# EAGLE design board (EAGLE 9.6.2)
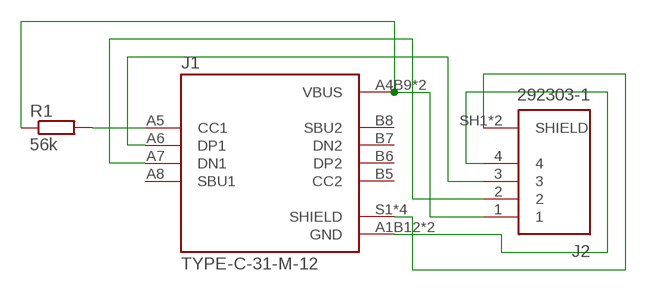
[diagram p0: schematic, sheet 1]

## Parts
J1  TYPE-C-31-M-12  [HRO_TYPE-C-31-M-12]
J2  292303-1  [292303-1]
R1  56k  RESISTOR-0603  [R0603]

## Nets
N$1: J1.A1B12(GND) J1.B1A12(GND) J2.4
N$2: J1.S1(SHIELD) J1.S2(SHIELD) J1.S3(SHIELD) J1.S4(SHIELD) J2.SH1(SHIELD) J2.SH2(SHIELD)
N$3: J1.A4B9(VBUS) J1.B4A9(VBUS) J2.1 R1.1
N$4: J1.A6(DP1) J2.3
N$5: J1.A7(DN1) J2.2
N$6: J1.A5(CC1) R1.2
Unconnected: J1.A8(SBU1) J1.B5(CC2) J1.B6(DP2) J1.B7(DN2) J1.B8(SBU2)

## Library data of the parts
J1 = TYPE-C-31-M-12:TYPE-C-31-M-12: USB Connectors 24 Receptacle 1 8.94*7.3mm RoHS; AVAILABILITY: Unavailable; DESCRIPTION: USB Connectors 24 Receptacle 1 8.94*7.3mm RoHS; MF: HRO Electronics Co., Ltd.; MP: TYPE-C-31-M-12; PACKAGE: Package; PRICE: None
J2 = USB connector:292303-1: CONN RCPT USB2.0 TYPEA 4POS R/A Manufacturer's datasheet <https://www.te.com/commerce/DocumentDelivery/DDEController?Action=srchrtrv&DocNm=292303&DocType=Customer+Drawing&DocLang=English>; CREATED_BY: PCBLayout.com; DIGIKEY_PARTNO: A31726-ND; MANUFACTURER: TE Connectivity AMP Connectors; MPN: 292303-1
R1 = Components:RESISTOR

## Board
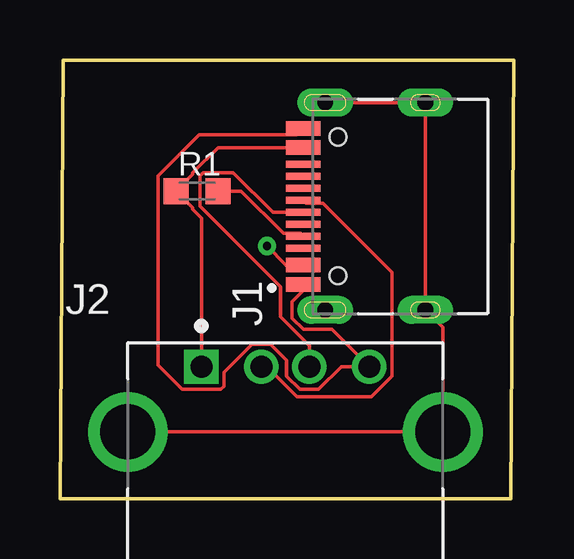
[diagram p1: board, top side]
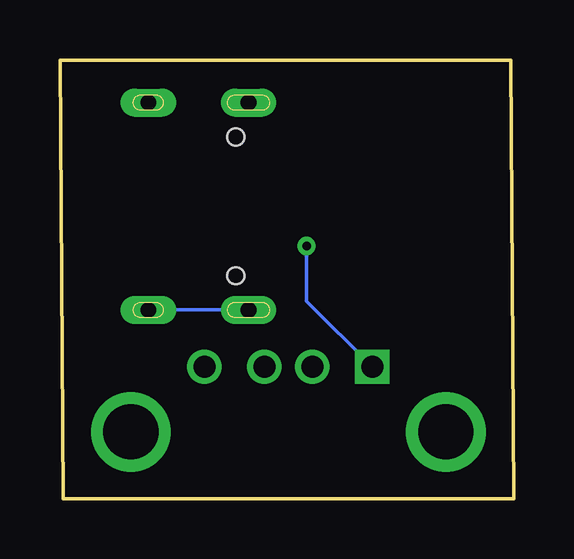
[diagram p2: board, bottom side, seen from below]

Size 18.92 x 18.29 mm. Coordinates in mm from the lower left corner, seen from the top.
Outline: 0,0 18.8,0 18.92,18.29 0.13,18.29 0,0
Copper layers (1*16): Top 0.035mm / dielectric 1.5mm / Bottom 0.035mm
Design rules "default": minimum track width 6mil, minimum drill 0.35mm, track to track 6mil, track to pad 6mil, pad to pad 6mil, via to via 6mil, smd to smd 6mil, copper to edge 40mil, drill to drill 6mil, minimum pad ring 10mil, minimum via ring 8mil, stop-mask expansion 4mil, vias tented up to drill 0mil, thermal gap 10mil

### Footprints (pad centres in the part's own frame; a part is rotated, then mirrored left to right if it is on the bottom)
HRO_TYPE-C-31-M-12 = smd 0.6 x 1.45: A1B12 -3.25,5.095; A4B9 -2.45,5.095; B1A12 3.25,5.095; B4A9 2.45,5.095 | smd 0.3 x 1.45: A5 -1.25,5.095; A6 -0.25,5.095; A7 0.25,5.095; A8 1.25,5.095; B5 1.75,5.095; B6 0.75,5.095; B7 -0.75,5.095; B8 -1.75,5.095 | drill 0.65 pad 1.05 long: S1 -4.32,4.18; S2 4.32,4.18; S3 -4.32,0; S4 4.32,0 | hole 0.7: -2.89,3.65; 2.89,3.65
292303-1 = drill 0.92 square: 1 -3.5,2.71 | drill 0.92: 2 -1,2.71; 3 1,2.71; 4 3.5,2.71 | drill 2.3: SH1 -6.57,0; SH2 6.57,0
R0603 = smd 1.05 x 1.08: 1 -0.875,0; 2 0.875,0

### Placement (x,y rotation side)
J1  15.24,12.19 90 top
J2  9.4,2.79 0 top
R1  5.71,12.83 0 top

### Tracks (layer width: path | path; a pad name or v marks a point on that pad's centre or on a via)
N$1
  Top 0.152: J1.A1B12 10.14,8.68 9.67,8.21 9.67,7.54 10.15,7.06 11.34,7.06 J2.4 11.73,5.5 10.79,4.56 10.01,4.56 9.46,5.11 9.46,5.78 8.79,6.45 8.01,6.45 6.84,5.28 6.84,4.7 6.71,4.56 5.09,4.56 4.09,5.56 4.09,13.46 5.79,15.17 9.87,15.17 J1.B1A12
N$2
  Top 0.152: J1.S2 J1.S4 J1.S3 15.97,7.14 J2.SH2 J2.SH1
  Bottom 0.152: J1.S1 J1.S3
N$3  (via drill 0.35)
  Top 0.152: J2.1 5.9,11.7 5.53,12.07 5.53,12.14 R1.1 5.53,13.52 5.53,13.59 6.59,14.64 J1.B4A9 | v8.64,10.54 9.44,9.74 J1.A4B9
  Bottom 0.152: J2.1 8.64,8.24 v8.64,10.54
N$4
  Top 0.152: J2.3 10.4,6.38 9.19,7.59 9.19,8.84 5.84,12.19 5.84,13.46 5.97,13.6 7.22,13.6 8.88,11.94 J1.A6
N$5
  Top 0.152: J1.A7 10.27,12.32 10.96,12.32 13.84,9.45 13.84,5.11 12.98,4.26 9.88,4.26 8.63,5.5 J2.2
N$6
  Top 0.152: J1.A5 10.02,11.06 9.32,11.06 7.56,12.83 R1.2